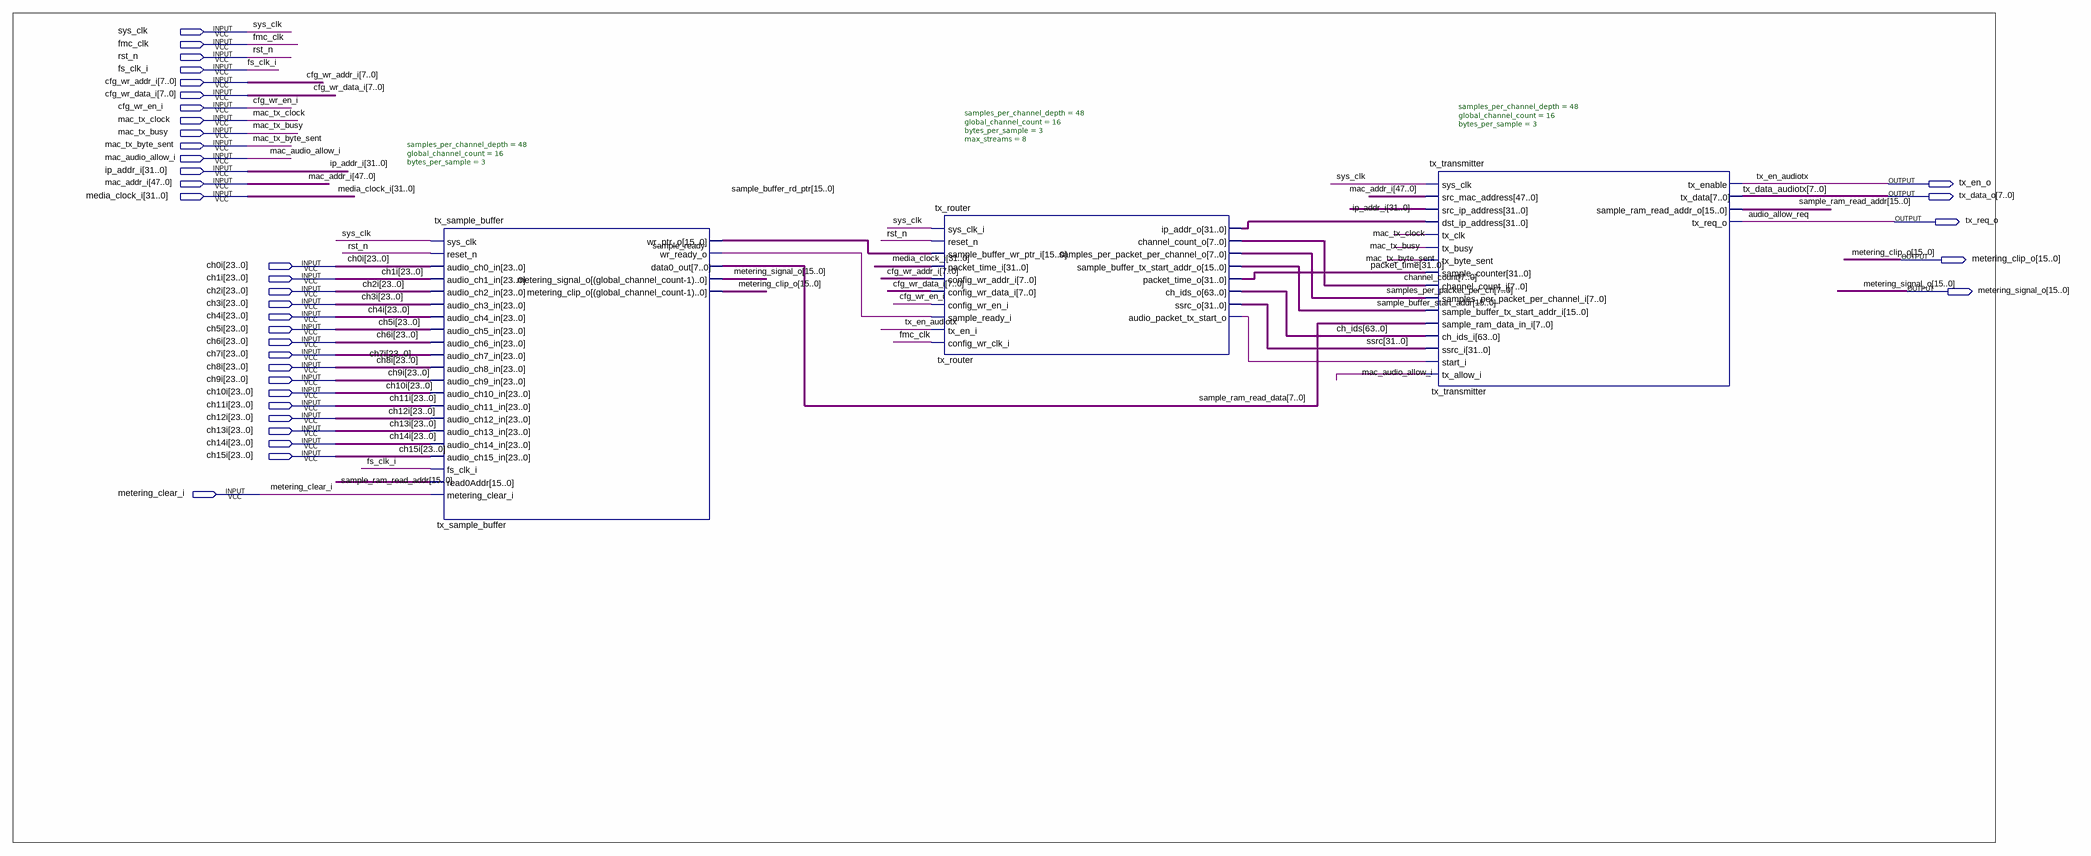
[diagram p0: schematic sheet]
// Quartus schematic audio_tx_module.bdf as structural Verilog: 3 symbols, 36 pins
module audio_tx_module (
  input  sys_clk,
  input  fmc_clk,
  input  rst_n,
  input  fs_clk_i,
  input  [7:0] cfg_wr_addr_i,
  input  [7:0] cfg_wr_data_i,
  input  cfg_wr_en_i,
  input  mac_tx_clock,
  input  mac_tx_busy,
  input  mac_tx_byte_sent,
  input  mac_audio_allow_i,
  input  [31:0] ip_addr_i,
  input  [47:0] mac_addr_i,
  input  [31:0] media_clock_i,
  input  [23:0] ch0i,
  input  [23:0] ch1i,
  input  [23:0] ch2i,
  input  [23:0] ch3i,
  input  [23:0] ch4i,
  input  [23:0] ch5i,
  input  [23:0] ch6i,
  input  [23:0] ch7i,
  input  [23:0] ch8i,
  input  [23:0] ch9i,
  input  [23:0] ch10i,
  input  [23:0] ch11i,
  input  [23:0] ch12i,
  input  [23:0] ch13i,
  input  [23:0] ch14i,
  input  [23:0] ch15i,
  input  metering_clear_i,
  output tx_en_o,
  output [7:0] tx_data_o,
  output tx_req_o,
  output [15:0] metering_clip_o,
  output [15:0] metering_signal_o
);

  wire sample_ready, tx_router_audio_packet_tx_start_o;
  wire [7:0] channel_count, sample_ram_read_data, samples_per_packet_per_ch;
  wire [15:0] sample_buffer_rd_ptr, sample_buffer_start_addr, sample_ram_read_addr;
  wire [31:0] packet_time, ssrc, tx_router_ip_addr_o;
  wire [63:0] ch_ids;

  tx_sample_buffer #(.samples_per_channel_depth(48), .global_channel_count(16), .bytes_per_sample(3)) tx_sample_buffer (
    .sys_clk(sys_clk), .reset_n(rst_n), .audio_ch0_in(ch0i), .audio_ch1_in(ch1i), .audio_ch2_in(ch2i),
    .audio_ch3_in(ch3i), .audio_ch4_in(ch4i), .audio_ch5_in(ch5i), .audio_ch6_in(ch6i), .audio_ch7_in(ch7i),
    .audio_ch8_in(ch8i), .audio_ch9_in(ch9i), .audio_ch10_in(ch10i), .audio_ch11_in(ch11i),
    .audio_ch12_in(ch12i), .audio_ch13_in(ch13i), .audio_ch14_in(ch14i), .audio_ch15_in(ch15i),
    .fs_clk_i(fs_clk_i), .read0Addr(sample_ram_read_addr), .metering_clear_i(metering_clear_i),
    .wr_ptr_o(sample_buffer_rd_ptr), .wr_ready_o(sample_ready), .data0_out(sample_ram_read_data),
    .metering_signal_o(metering_signal_o), .metering_clip_o(metering_clip_o));
  tx_router #(.samples_per_channel_depth(48), .global_channel_count(16), .bytes_per_sample(3), .max_streams(8)) tx_router (
    .sys_clk_i(sys_clk), .reset_n(rst_n), .sample_buffer_wr_ptr_i(sample_buffer_rd_ptr),
    .packet_time_i(media_clock_i), .config_wr_addr_i(cfg_wr_addr_i), .config_wr_data_i(cfg_wr_data_i),
    .config_wr_en_i(cfg_wr_en_i), .sample_ready_i(sample_ready), .tx_en_i(tx_en_o),
    .config_wr_clk_i(fmc_clk), .ip_addr_o(tx_router_ip_addr_o), .channel_count_o(channel_count),
    .samples_per_packet_per_channel_o(samples_per_packet_per_ch),
    .sample_buffer_tx_start_addr_o(sample_buffer_start_addr), .packet_time_o(packet_time), .ch_ids_o(ch_ids),
    .ssrc_o(ssrc), .audio_packet_tx_start_o(tx_router_audio_packet_tx_start_o));
  tx_transmitter #(.samples_per_channel_depth(48), .global_channel_count(16), .bytes_per_sample(3)) tx_transmitter (
    .sys_clk(sys_clk), .src_mac_address(mac_addr_i), .src_ip_address(ip_addr_i),
    .dst_ip_address(tx_router_ip_addr_o), .tx_clk(mac_tx_clock), .tx_busy(mac_tx_busy),
    .tx_byte_sent(mac_tx_byte_sent), .sample_counter(packet_time), .channel_count_i(channel_count),
    .samples_per_packet_per_channel_i(samples_per_packet_per_ch),
    .sample_buffer_tx_start_addr_i(sample_buffer_start_addr), .sample_ram_data_in_i(sample_ram_read_data),
    .ch_ids_i(ch_ids), .ssrc_i(ssrc), .start_i(tx_router_audio_packet_tx_start_o),
    .tx_allow_i(mac_audio_allow_i), .tx_enable(tx_en_o), .tx_data(tx_data_o),
    .sample_ram_read_addr_o(sample_ram_read_addr), .tx_req_o(tx_req_o));

  // Other names for the same wires on the sheet: audio_allow_req = tx_req_o; tx_data_audiotx[7:0] = tx_data_o;
  //   tx_en_audiotx = tx_en_o
endmodule
